# Altium schematic sheet FPGA_U1_Auto.SchDoc
size A3; Organization: Microprocessor-Design Pty Ltd; Address1: 18/110 Caroline Street; Address2: South Yarra; Address3: VIC 3141; Address4: Australia; DocumentNumber: 4; SheetNumber: 4; SheetTotal: 4; Generated From FPGA Project: SoIrDA.PrjFpg; UNUSED_SPECIAL: NoERC; UNUSED_IO: NoERC; VREF: NoERC; UNUSED_INPUT: NoERC
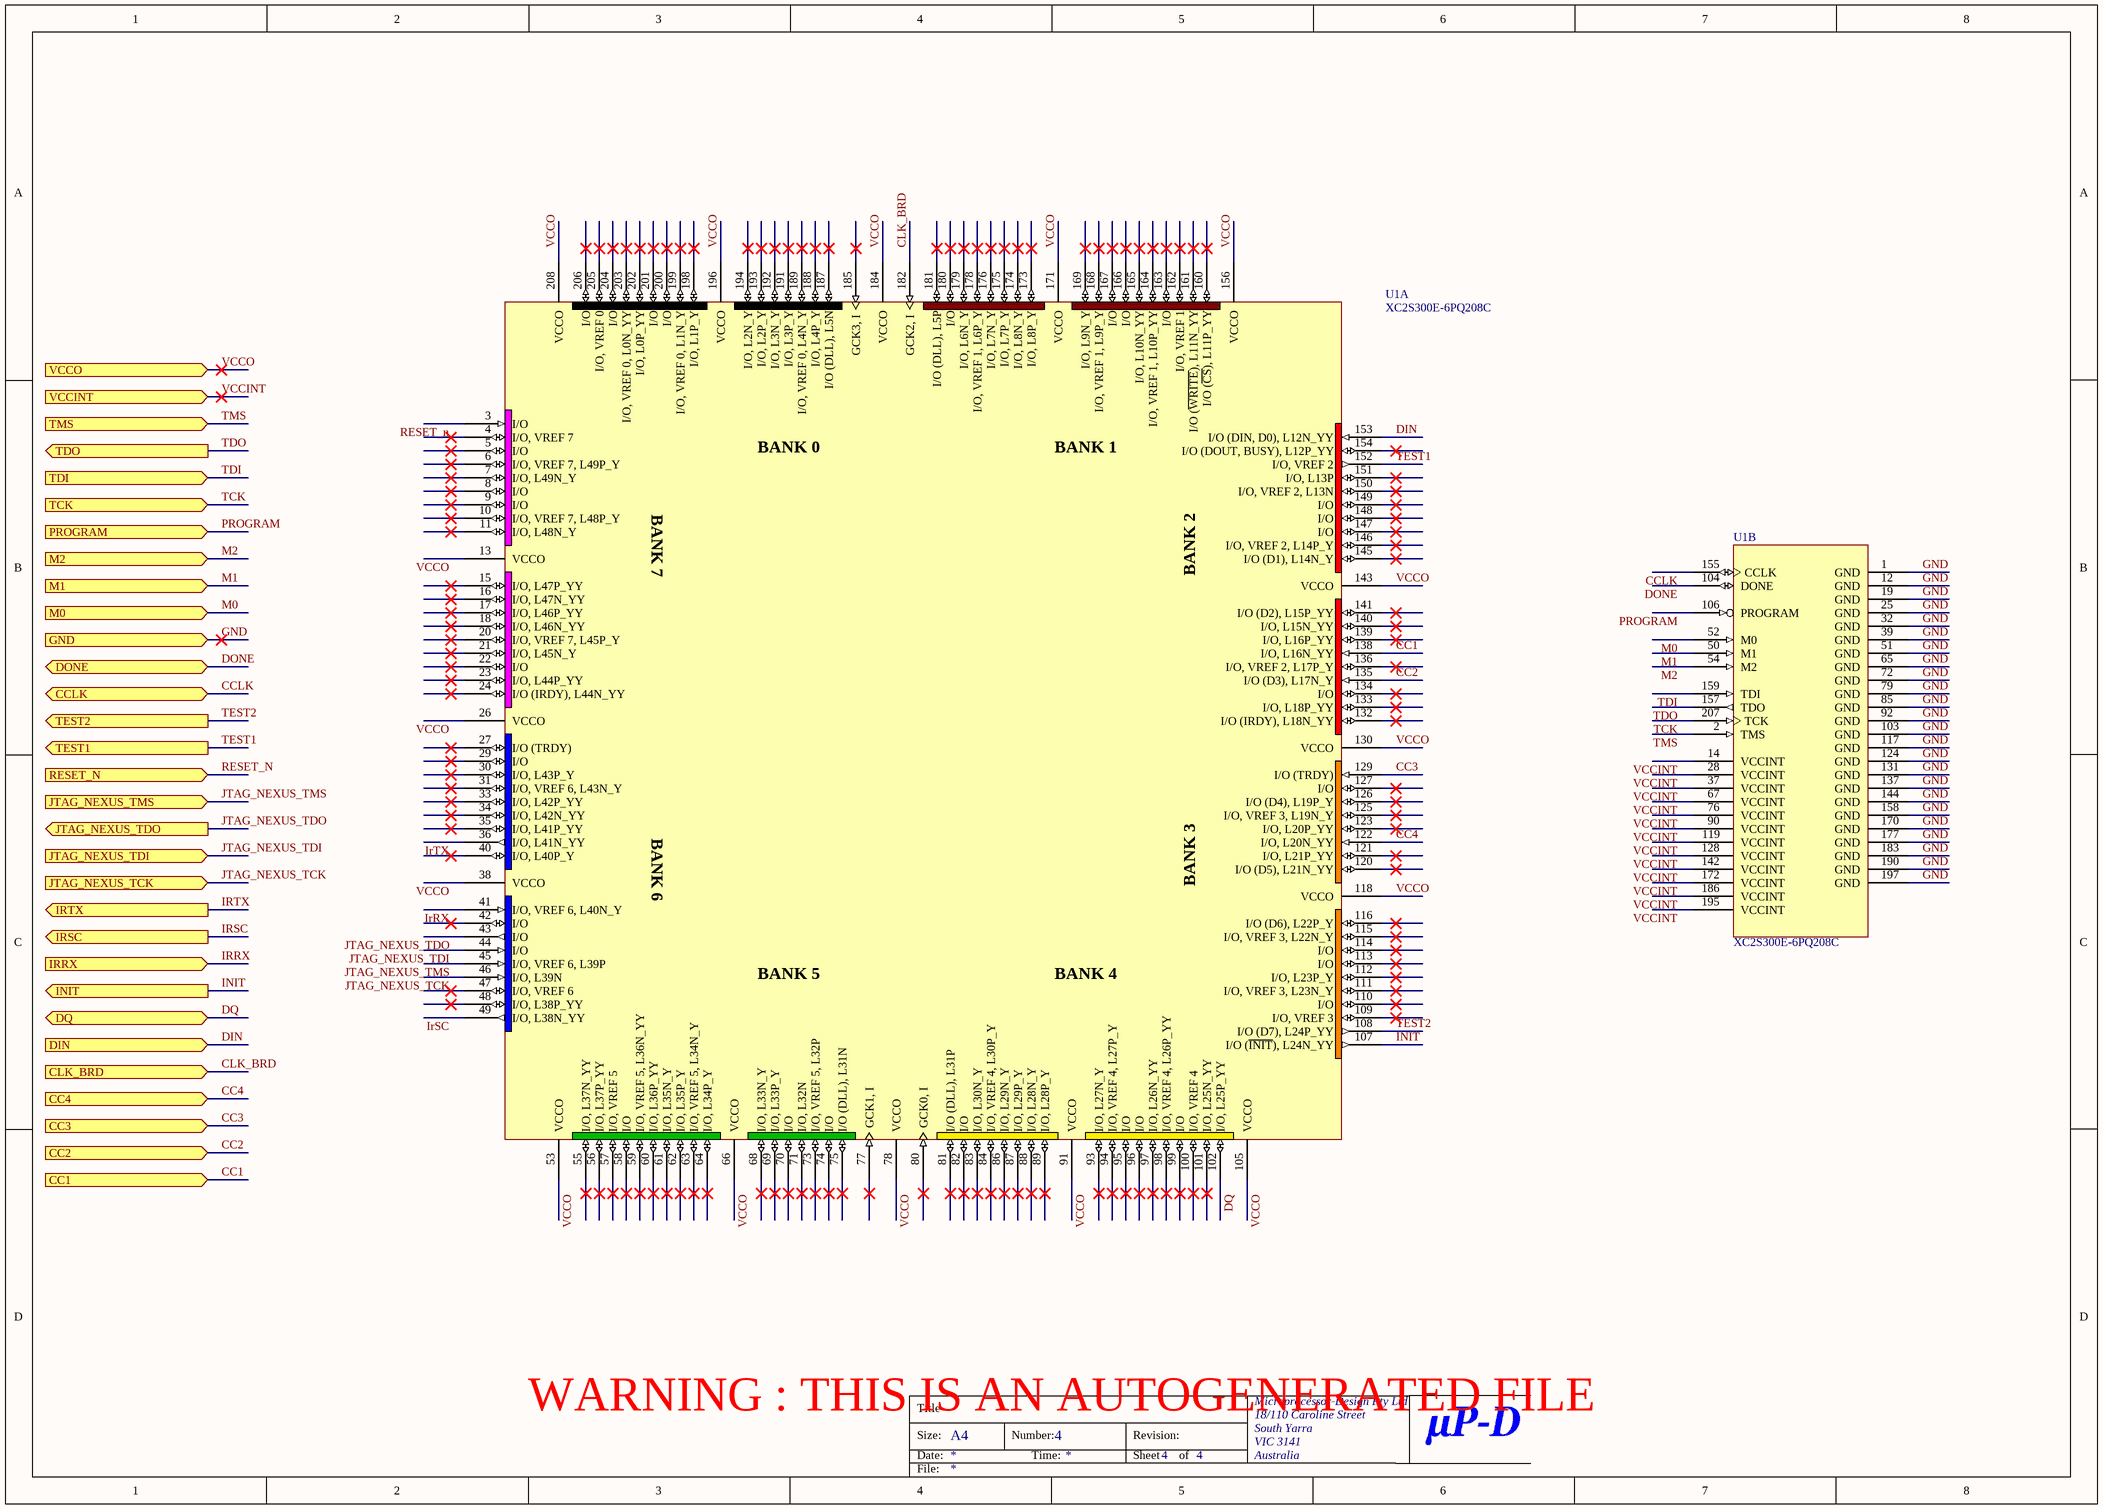
[diagram p0: FPGA_U1_Auto.SchDoc]

## Parts
U1  XC2S300E-6PQ208C  [PQ208]  (parts A,B of 2)

## Ports
CC1 (in), CC2 (in), CC3 (in), CC4 (in), CCLK (bidir), CLK_BRD (in), DIN (in), DONE (bidir), DQ (bidir), GND (in), INIT (out), IRRX (in), IRSC (out), IRTX (out), JTAG_NEXUS_TCK (in), JTAG_NEXUS_TDI (in), JTAG_NEXUS_TDO (out), JTAG_NEXUS_TMS (in), M0 (in), M1 (in), M2 (in), PROGRAM (in), RESET_N (in), TCK (in), TDI (in), TDO (out), TEST1 (out), TEST2 (out), TMS (in), VCCINT (in), VCCO (in)

## Nets
CC1: U1.138(I/O,_L16N_YY) ; port CC1
CC2: U1.135(I/O_(D3),_L17N_Y) ; port CC2
CC3: U1.129(I/O_(TRDY)) ; port CC3
CC4: U1.122(I/O,_L20N_YY) ; port CC4
CCLK: U1.155(CCLK) ; port CCLK
CLK_BRD: U1.182(GCK2,_I) ; port CLK_BRD
DIN: U1.153(I/O_(DIN,_D0),_L12N_YY) ; port DIN
DONE: U1.104(DONE) ; port DONE
DQ: U1.102(I/O,_L25P_YY) ; port DQ
GND: U1.1(GND) U1.12(GND) U1.19(GND) U1.25(GND) U1.32(GND) U1.39(GND) U1.51(GND) U1.65(GND) U1.72(GND) U1.79(GND) U1.85(GND) U1.92(GND) U1.103(GND) U1.117(GND) U1.124(GND) U1.131(GND) U1.137(GND) U1.144(GND) U1.158(GND) U1.170(GND) U1.177(GND) U1.183(GND) U1.190(GND) U1.197(GND) ; port GND
INIT: U1.107(I/O_(~{INIT}),_L24N_YY) ; port INIT
IrRX: U1.41(I/O,_VREF_6,_L40N_Y) ; port IRRX
IrSC: U1.49(I/O,_L38N_YY) ; port IRSC
IrTX: U1.36(I/O,_L41N_YY) ; port IRTX
JTAG_NEXUS_TCK: U1.46(I/O,_L39N) ; port JTAG_NEXUS_TCK
JTAG_NEXUS_TDI: U1.44(I/O) ; port JTAG_NEXUS_TDI
JTAG_NEXUS_TDO: U1.43(I/O) ; port JTAG_NEXUS_TDO
JTAG_NEXUS_TMS: U1.45(I/O,_VREF_6,_L39P) ; port JTAG_NEXUS_TMS
M0: U1.52(M0) ; port M0
M1: U1.50(M1) ; port M1
M2: U1.54(M2) ; port M2
PROGRAM: U1.106(PROGRAM) ; port PROGRAM
RESET_n: U1.3(I/O) ; port RESET_N
TCK: U1.207(TCK) ; port TCK
TDI: U1.159(TDI) ; port TDI
TDO: U1.157(TDO) ; port TDO
TEST1: U1.152(I/O,_VREF_2) ; port TEST1
TEST2: U1.108(I/O_(D7),_L24P_YY) ; port TEST2
TMS: U1.2(TMS) ; port TMS
VCCINT: U1.14(VCCINT) U1.28(VCCINT) U1.37(VCCINT) U1.67(VCCINT) U1.76(VCCINT) U1.90(VCCINT) U1.119(VCCINT) U1.128(VCCINT) U1.142(VCCINT) U1.172(VCCINT) U1.186(VCCINT) U1.195(VCCINT) ; port VCCINT
VCCO: U1.13(VCCO) U1.26(VCCO) U1.38(VCCO) U1.53(VCCO) U1.66(VCCO) U1.78(VCCO) U1.91(VCCO) U1.105(VCCO) U1.118(VCCO) U1.130(VCCO) U1.143(VCCO) U1.156(VCCO) U1.171(VCCO) U1.184(VCCO) U1.196(VCCO) U1.208(VCCO) ; port VCCO

Not connected (* = marked no-connect by the designer): U1 4(I/O,_VREF_7)* 5(I/O)* 6(I/O,_VREF_7,_L49P_Y)* 7(I/O,_L49N_Y)* 8(I/O)* 9(I/O)* 10(I/O,_VREF_7,_L48P_Y)* 11(I/O,_L48N_Y)* 15(I/O,_L47P_YY)* 16(I/O,_L47N_YY)* 17(I/O,_L46P_YY)* 18(I/O,_L46N_YY)* 20(I/O,_VREF_7,_L45P_Y)* 21(I/O,_L45N_Y)* 22(I/O)* 23(I/O,_L44P_YY)* 24(I/O_(IRDY),_L44N_YY)* 27(I/O_(TRDY))* 29(I/O)* 30(I/O,_L43P_Y)* 31(I/O,_VREF_6,_L43N_Y)* 33(I/O,_L42P_YY)* 34(I/O,_L42N_YY)* 35(I/O,_L41P_YY)* 40(I/O,_L40P_Y)* 42(I/O)* 47(I/O,_VREF_6)* 48(I/O,_L38P_YY)* 55(I/O,_L37N_YY)* 56(I/O,_L37P_YY)* 57(I/O,_VREF_5)* 58(I/O)* 59(I/O,_VREF_5,_L36N_YY)* 60(I/O,_L36P_YY)* 61(I/O,_L35N_Y)* 62(I/O,_L35P_Y)* 63(I/O,_VREF_5,_L34N_Y)* 64(I/O,_L34P_Y)* 68(I/O,_L33N_Y)* 69(I/O,_L33P_Y)* 70(I/O)* 71(I/O,_L32N)* 73(I/O,_VREF_5,_L32P)* 74(I/O)* 75(I/O_(DLL),_L31N)* 77(GCK1,_I)* 80(GCK0,_I)* 81(I/O_(DLL),_L31P)* 82(I/O)* 83(I/O,_L30N_Y)* 84(I/O,_VREF_4,_L30P_Y)* 86(I/O,_L29N_Y)* 87(I/O,_L29P_Y)* 88(I/O,_L28N_Y)* 89(I/O,_L28P_Y)* 93(I/O,_L27N_Y)* 94(I/O,_VREF_4,_L27P_Y)* 95(I/O)* 96(I/O)* 97(I/O,_L26N_YY)* 98(I/O,_VREF_4,_L26P_YY)* 99(I/O)* 100(I/O,_VREF_4)* 101(I/O,_L25N_YY)* 109(I/O,_VREF_3)* 110(I/O)* 111(I/O,_VREF_3,_L23N_Y)* 112(I/O,_L23P_Y)* 113(I/O)* 114(I/O)* 115(I/O,_VREF_3,_L22N_Y)* 116(I/O_(D6),_L22P_Y)* 120(I/O_(D5),_L21N_YY)* 121(I/O,_L21P_YY)* 123(I/O,_L20P_YY)* 125(I/O,_VREF_3,_L19N_Y)* 126(I/O_(D4),_L19P_Y)* 127(I/O)* 132(I/O_(IRDY),_L18N_YY)* 133(I/O,_L18P_YY)* 134(I/O)* 136(I/O,_VREF_2,_L17P_Y)* 139(I/O,_L16P_YY)* 140(I/O,_L15N_YY)* 141(I/O_(D2),_L15P_YY)* 145(I/O_(D1),_L14N_Y)* 146(I/O,_VREF_2,_L14P_Y)* 147(I/O)* 148(I/O)* 149(I/O)* 150(I/O,_VREF_2,_L13N)* 151(I/O,_L13P)* 154(I/O_(DOUT,_BUSY),_L12P_YY)* 160(I/O_(~{CS}),_L11P_YY)* 161(I/O_(~{WRITE}),_L11N_YY)* 162(I/O,_VREF_1)* 163(I/O)* 164(I/O,_VREF_1,_L10P_YY)* 165(I/O,_L10N_YY)* 166(I/O)* 167(I/O)* 168(I/O,_VREF_1,_L9P_Y)* 169(I/O,_L9N_Y)* 173(I/O,_L8P_Y)* 174(I/O,_L8N_Y)* 175(I/O,_L7P_Y)* 176(I/O,_L7N_Y)* 178(I/O,_VREF_1,_L6P_Y)* 179(I/O,_L6N_Y)* 180(I/O)* 181(I/O_(DLL),_L5P)* 185(GCK3,_I)* 187(I/O_(DLL),_L5N)* 188(I/O,_L4P_Y)* 189(I/O,_VREF_0,_L4N_Y)* 191(I/O,_L3P_Y)* 192(I/O,_L3N_Y)* 193(I/O,_L2P_Y)* 194(I/O,_L2N_Y)* 198(I/O,_L1P_Y)* 199(I/O,_VREF_0,_L1N_Y)* 200(I/O)* 201(I/O)* 202(I/O,_L0P_YY)* 203(I/O,_VREF_0,_L0N_YY)* 204(I/O)* 205(I/O,_VREF_0)* 206(I/O)*

## Notes on the sheet
- WARNING : THIS IS AN AUTOGENERATED FILE
- Title
- Size:
- Date:
- A4
- Number:
- Time:
- Revision:
- Sheet
- of
- File:
- (in symbol XC2S300E-6PQ208C, part A) BANK 0; BANK 1; BANK 7; BANK 2; BANK 6; BANK 3; BANK 5; BANK 4

## Library data of the parts
U1 = XC2S300E-6PQ208C: Spartan-IIE 1.8V FPGA, 208-Pin PQFP, Standard Performance, Commercial Grade; Package Information: Latest Revision: ver1.1, Oct-2002; Code - JEDEC: MS-029-FA-1; Published: 19-Jul-2002; Revision: 17-Sep-2003: Pin names updated to match datasheet, ver2.1.; Datasheet: Latest Revision: 09-Jul-2003; Package Reference: PQ208; Publisher: Altium Limited